# Altium schematic sheet power.SchDoc
size A3; SheetNumber: 3; SheetTotal: 5
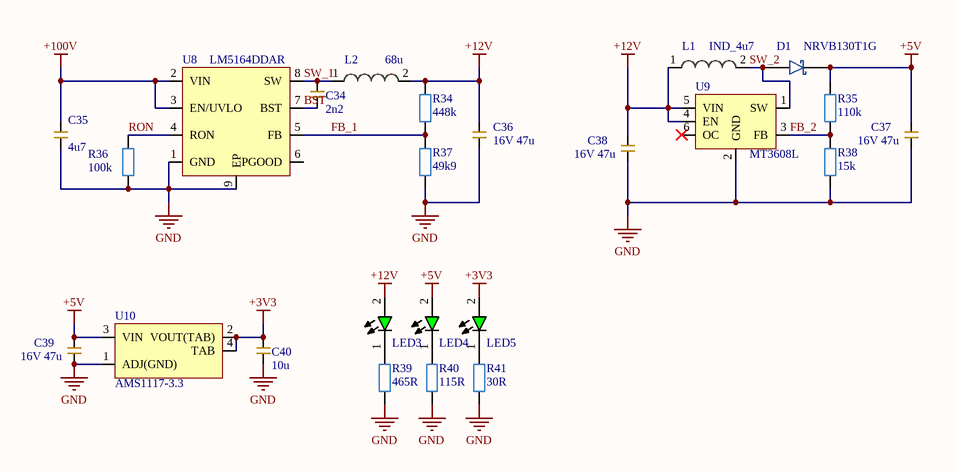
[diagram p0: power.SchDoc]

## Parts
C34  2n2  [CAP_0603]
C35  4u7  [FS32X475K101EGG]
C36  16V 47u  [CAP_1210]
C37  16V 47u  [CAP_1210]
C38  16V 47u  [CAP_1210]
C39  16V 47u  [CAP_1210]
C40  10u  [CAP_0603]
D1  NRVB130T1G  [NRVB130T1G]
L1  IND_4u7  [FTC252010S4R7MBCA]
L2  68u  [SMMS0650-680M]
LED3  GREEN_0603  [GREEN_0603]  (value not drawn)
LED4  GREEN_0603  [GREEN_0603]  (value not drawn)
LED5  GREEN_0603  [GREEN_0603]  (value not drawn)
R34  448k  [RES_0603]
R35  110k  [RES_0603]
R36  100k  [RES_0603]
R37  49k9  [RES_0603]
R38  15k  [RES_0603]
R39  465R  [RES_0603]
R40  115R  [RES_0603]
R41  30R  [RES_0603]
U8  LM5164DDAR  [LM5164DDAR]
U9  MT3608L  [MT3608L]
U10  AMS1117-3.3  [AMS1117-3.3]

## Nets
+3V3: C40.2 LED5.2(A) U10.2(VOUT(TAB)) U10.4(TAB)
+5V: C37.2 C39.2 D1.1 LED4.2(A) R35.2 U10.3(VIN)
+12V: C36.2 C38.2 L1.1 L2.2 LED3.2(A) R34.2 U9.4(EN) U9.5(VIN)
+100V: C35.2 U8.2(VIN) U8.3(EN/UVLO)
GND: C35.1 C36.1 C37.1 C38.1 C39.1 C40.1 R36.1 R37.1 R38.1 R39.1 R40.1 R41.1 U8.1(GND) U8.9(EP) U9.2(GND) U10.1(ADJ(GND))
BST: C34.1 U8.7(BST)
FB_1: R34.1 R37.2 U8.5(FB)
FB_2: R35.1 R38.2 U9.3(FB)
RON: R36.2 U8.4(RON)
SW_1: C34.2 L2.1 U8.8(SW)
SW_2: D1.2 L1.2 U9.1(SW)
NetLED3_1: LED3.1(K) R39.2
NetLED4_1: LED4.1(K) R40.2
NetLED5_1: LED5.1(K) R41.2

Not connected (* = marked no-connect by the designer): U8 6(PGOOD); U9 6(OC)*

## Library data of the parts
C34 C40 = CAP_0603: Multilayer Ceramic Capacitors MLCC - SMD/SMT ROHS; Mfr.: *; Voltage Rating: *; Package: 0603; LCSC: *; Mfr. Part: *
  C34: ClassName: DCDC100
  C40: ClassName: LINREG
C35 = 4u7: 100V 4.7uF X7R ±10% 1210 Multilayer Ceramic Capacitors MLCC - SMD/SMT ROHS; Mfr.: PSA(Prosperity Dielectrics); Voltage Rating: 100V; Package: 1210; LCSC: C381466; Mfr. Part: FS32X475K101EGG; ClassName: DCDC100
C36-C39 = CAP_1210: 16V 47uF X5R ±10% 1210 Multilayer Ceramic Capacitors MLCC - SMD/SMT ROHS; Mfr.: Murata Electronics; Mfr. Part: GRM32ER61C476KE15L; Voltage Rating: 16V; Package: 1210; LCSC: C77101
  C36: ClassName: DCDC100
  C37 C38: ClassName: DCDC5
  C39: ClassName: LINREG
D1 = NRVB130T1G: 30V 1A 350mV@100mA SOD-123 Schottky Diodes ROHS; Mfr.: JSMSEMI; LCSC: C917121; Mfr. Part: NRVB130T1G; ClassName: DCDC5
L1 = IND_4u7: 2A 4.7uH Integrated molded inductor ±20% 2.6A SMD,2x2.5mm Power Inductors ROHS; Mfr.: cjiang (Changjiang Microelectronics Tech); Mfr. Part: FTC252010S4R7MBCA; LCSC: C5832360; Package: SMD,2x2.5mm; ClassName: DCDC5
L2 = IND_68u: 1.5A 68uH Integrated molded inductor ±20% 2A SMD,6.6x7.1mm Power Inductors ROHS; Mfr.: SXN(Shun Xiang Nuo Elec); Mfr. Part: SMMS0650-680M; LCSC: C2894721; Package: SMD,6.6x7.1mm; ClassName: DCDC100
LED3-LED5 = GREEN_0603: 20mA 810mcd Colorless Transparent Lens Independent Diode 515nm~535nm -20℃~+85℃ Positive Stick Emerald 120° 70mW 3.3V 0603 LED Indication - Discrete ROHS; Mfr.: XINGLIGHT; Mfr. Part: XL-1608UGC-04; LCSC: C965804; Package: 0603
R34-R41 = RES_0603: 100mW Thick Film Resistors; Voltage Rating: *; Mfr. Part: *; Package: 0603; LCSC: *; Mfr.: *
  R34 R36 R37: ClassName: DCDC100
  R35 R38: ClassName: DCDC5
U8 = LM5164DDAR: Step-down type 1A 6V~100V SO-8-EP DC-DC Converters ROHS; Mfr.: Texas Instruments; Mfr. Part: LM5164DDAR; LCSC: C477928; ClassName: DCDC100
U9 = MT3608L: 2.2V~16V 2.5A SOT-23-6 DC-DC Converters ROHS; Mfr.: XI'AN Aerosemi Tech; Mfr. Part: MT3608L; LCSC: C2932326; ClassName: DCDC5
U10 = AMS1117-3.3: 1A 60dB@(120Hz) Fixed 3.3V Positive electrode 12V SOT-223 Voltage Regulators - Linear, Low Drop Out (LDO) Regulators ROHS; Mfr.: UMW(Youtai Semiconductor Co., Ltd.); Mfr. Part: AMS1117-3.3; LCSC: C347222; ClassName: LINREG